# EasyEDA Pro project ProPrj_遥控_2025-12-06.epro, board 5V升压(2-5V -> 5V）
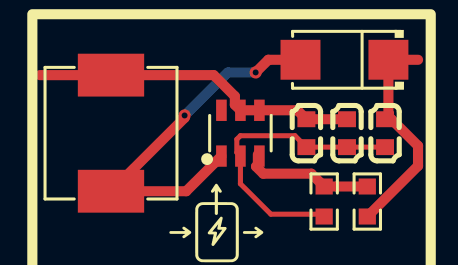
[diagram p15: board, top side]
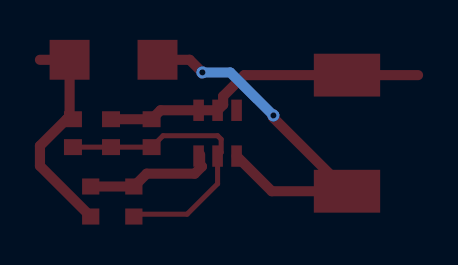
[diagram p16: board, bottom side, seen from below]

No outline. copper layers: Top Layer, Bottom Layer. Coordinates in mm from the lowest, leftmost part position.
Stack: Top Layer 0.035mm / Dielectric1 1.51mm FR4 er 4.5 / Bottom Layer 0.035mm

## Design rules (mm)
template: JLCPCB Capability(Two Layers Board)
spacing copperThickness1oz (default): track to track 0.102, other pairs 0.152 to 0.3
spacing copperThickness2oz: track to track 0.203, other pairs 0.152 to 0.3
track width copperThickness1oz (default): min 0.127, default 0.254, max 2.54
track width copperThickness2oz: min 0.203, default 0.254, max 2.54
differential pair differentialPair (default): width min 0.127, default 0.254, max 2.54; gap min 0.152, default 0.152
via viaSize (default): diameter min 0.5, default 0.61, max 10; hole min 0.3, default 0.305, max 6.3

## Placement (name value [footprint] x y rotation side)
C6  10uF  [C0603]  13.72 3.43 90 top
C8  10uF  [C0603]  9.78 3.43 90 top
C9  100nF  [C0603]  11.81 3.43 90 top
D1  SS34  [SMA_L4.3-W2.6-LS5.2-RD]  11.68 7.11 180 top
L1  22uH  [IND-SMD_L7.1-W6.6]  0 3.43 270 top
R1  9kΩ  [R0603]  12.83 0 90 top
R2  1kΩ  [R0603]  10.67 0 270 top
U3  MT3608  [SOT-23-6_L2.9-W1.6-P0.95-LS2.8-BL]  6.48 3.43 0 top

## Footprints (pads in the part's own frame, mm; a bottom-side part is the same pattern mirrored in y, then rotated)
C0603
  rect 0.8x0.9 smd: 1(-0.7,0) 2(0.7,0)
IND-SMD_L7.1-W6.6
  rect 2.15x3.32 smd: 1(-2.913,0) 2(2.913,0)
R0603
  rect 0.806x0.864 smd: 1(-0.753,0) 2(0.753,0)
SMA_L4.3-W2.6-LS5.2-RD
  rect 2x2 smd: 1(-2.2,0) 2(2.2,0)
SOT-23-6_L2.9-W1.6-P0.95-LS2.8-BL
  rect 0.532x1.072 smd: 1(-0.95,-1.149) 2(0,-1.149) 3(0.95,-1.149) 4(0.95,1.149) 5(0,1.149) 6(-0.95,1.149)

## Nets
As in the schematic.

Pads without a net: U3 6

## Via types
v1: diameter 0.61, hole 0.305, Top Layer to Bottom Layer, 2 vias

## Routing (per net, layer and track width the routed paths; a pad name or vN(x,y) marks a point on that pad's centre or on a via; arc(x,y) is an arc through that point)
5V: length 11.3
  Top Layer w0.508: 15.37,7.11 D1.1 13.88,4.3 C6.2 14.03,4.13 15.37,2.79 15.37,1.79 R1.1
GND: length 14.9
  Top Layer w0.254: C6.1 C9.1 C8.1 9.21,3.3 6.48,3.3 6.3,3.12 6.3,2.46 U3.2 6.48,0.89 8,-0.63 10.55,-0.63 R2.2
VIN: length 16.5
  Top Layer w0.508: C9.2 C8.2 9.33,4.58 U3.4 U3.5 6.2,4.86 6.2,5.28 5.14,6.34 L1.1 -3.56,6.34
$1N551: length 18.5
  Top Layer w0.508: D1.2 7.87,7.11 v1(7.24,6.48) ; v1(3.68,4.32) 3.68,4.2 L1.2 3.76,0.52 5.53,2.28
  Bottom Layer w0.508: v1(7.24,6.48) 5.84,6.48 v1(3.68,4.32)
$1N553: length 6.6
  Top Layer w0.508: 7.35,2.36 7.35,1.85 7.26,1.76 7.62,1.4 10.02,1.4 R2.1 R1.2
